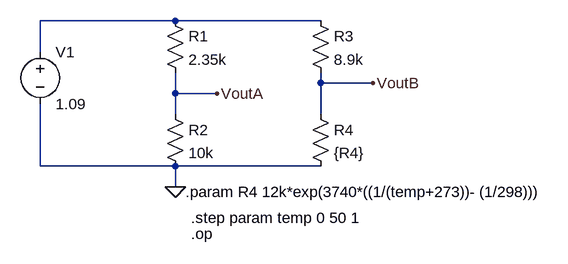
[diagram p0: schematic ponteWheatstone_Termistor.asc]
ponteWheatstone_Termistor.asc, the LTspice schematic file:
Version 4
SHEET 1 880 680
WIRE 128 64 -80 64
WIRE 352 64 128 64
WIRE -80 112 -80 64
WIRE 352 160 352 144
WIRE 432 160 352 160
WIRE 128 176 128 144
WIRE 192 176 128 176
WIRE 128 208 128 176
WIRE 352 208 352 160
WIRE -80 288 -80 192
WIRE 128 288 -80 288
WIRE 352 288 128 288
WIRE 128 320 128 288
FLAG 192 176 VoutA
FLAG 432 160 VoutB
FLAG 128 320 0
SYMBOL voltage -80 96 R0
WINDOW 123 0 0 Left 0
WINDOW 39 0 0 Left 0
SYMATTR InstName V1
SYMATTR Value 1.09
SYMBOL res 112 48 R0
SYMATTR InstName R1
SYMATTR Value 2.35k
SYMBOL res 112 192 R0
SYMATTR InstName R2
SYMATTR Value 10k
SYMBOL res 336 48 R0
SYMATTR InstName R3
SYMATTR Value 8.9k
SYMBOL res 336 192 R0
SYMATTR InstName R4
SYMATTR Value {R4}
TEXT 144 328 Left 2 !.param R4 12k*exp(3740*((1/(temp+273))- (1/298)))
TEXT 152 368 Left 2 !.step param temp 0 50 1
TEXT 152 392 Left 2 !.op

The netlist it stands for:
* ponteWheatstone_Termistor.asc
V1 N001 0 1.09
R1 N001 VoutA 2.35k
R2 VoutA 0 10k
R3 N001 VoutB 8.9k
R4 VoutB 0 {R4}
.param R4 12k*exp(3740*((1/(temp+273))- (1/298)))
.step param temp 0 50 1
.op
.backanno
.end

* Results of the author's LTspice run, read from the files saved beside the schematic
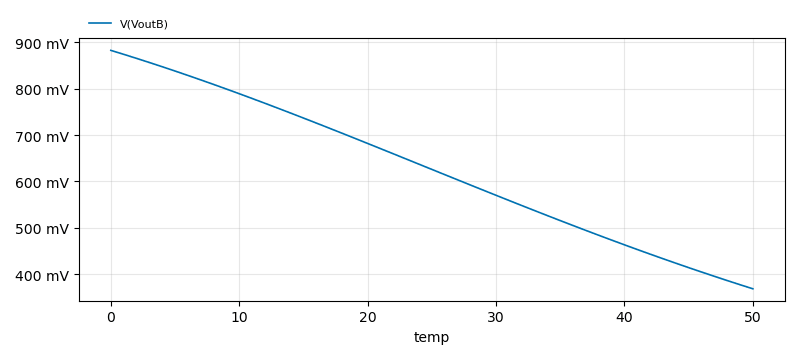
[diagram p1: Operating Point of ponteWheatstone_Termistor.asc, plotted from the saved traces]
* Operating Point, 1 run:
*   V(VoutB): 882.6 mV at temp=0, 368.3 mV at temp=50 , min 368.3 mV, max 882.6 mV